# EAGLE design cryptostick-0v1 (EAGLE 6.6.0)

## Sheet 1 of 3: FTDI USB-Conn., FTDI-Chip
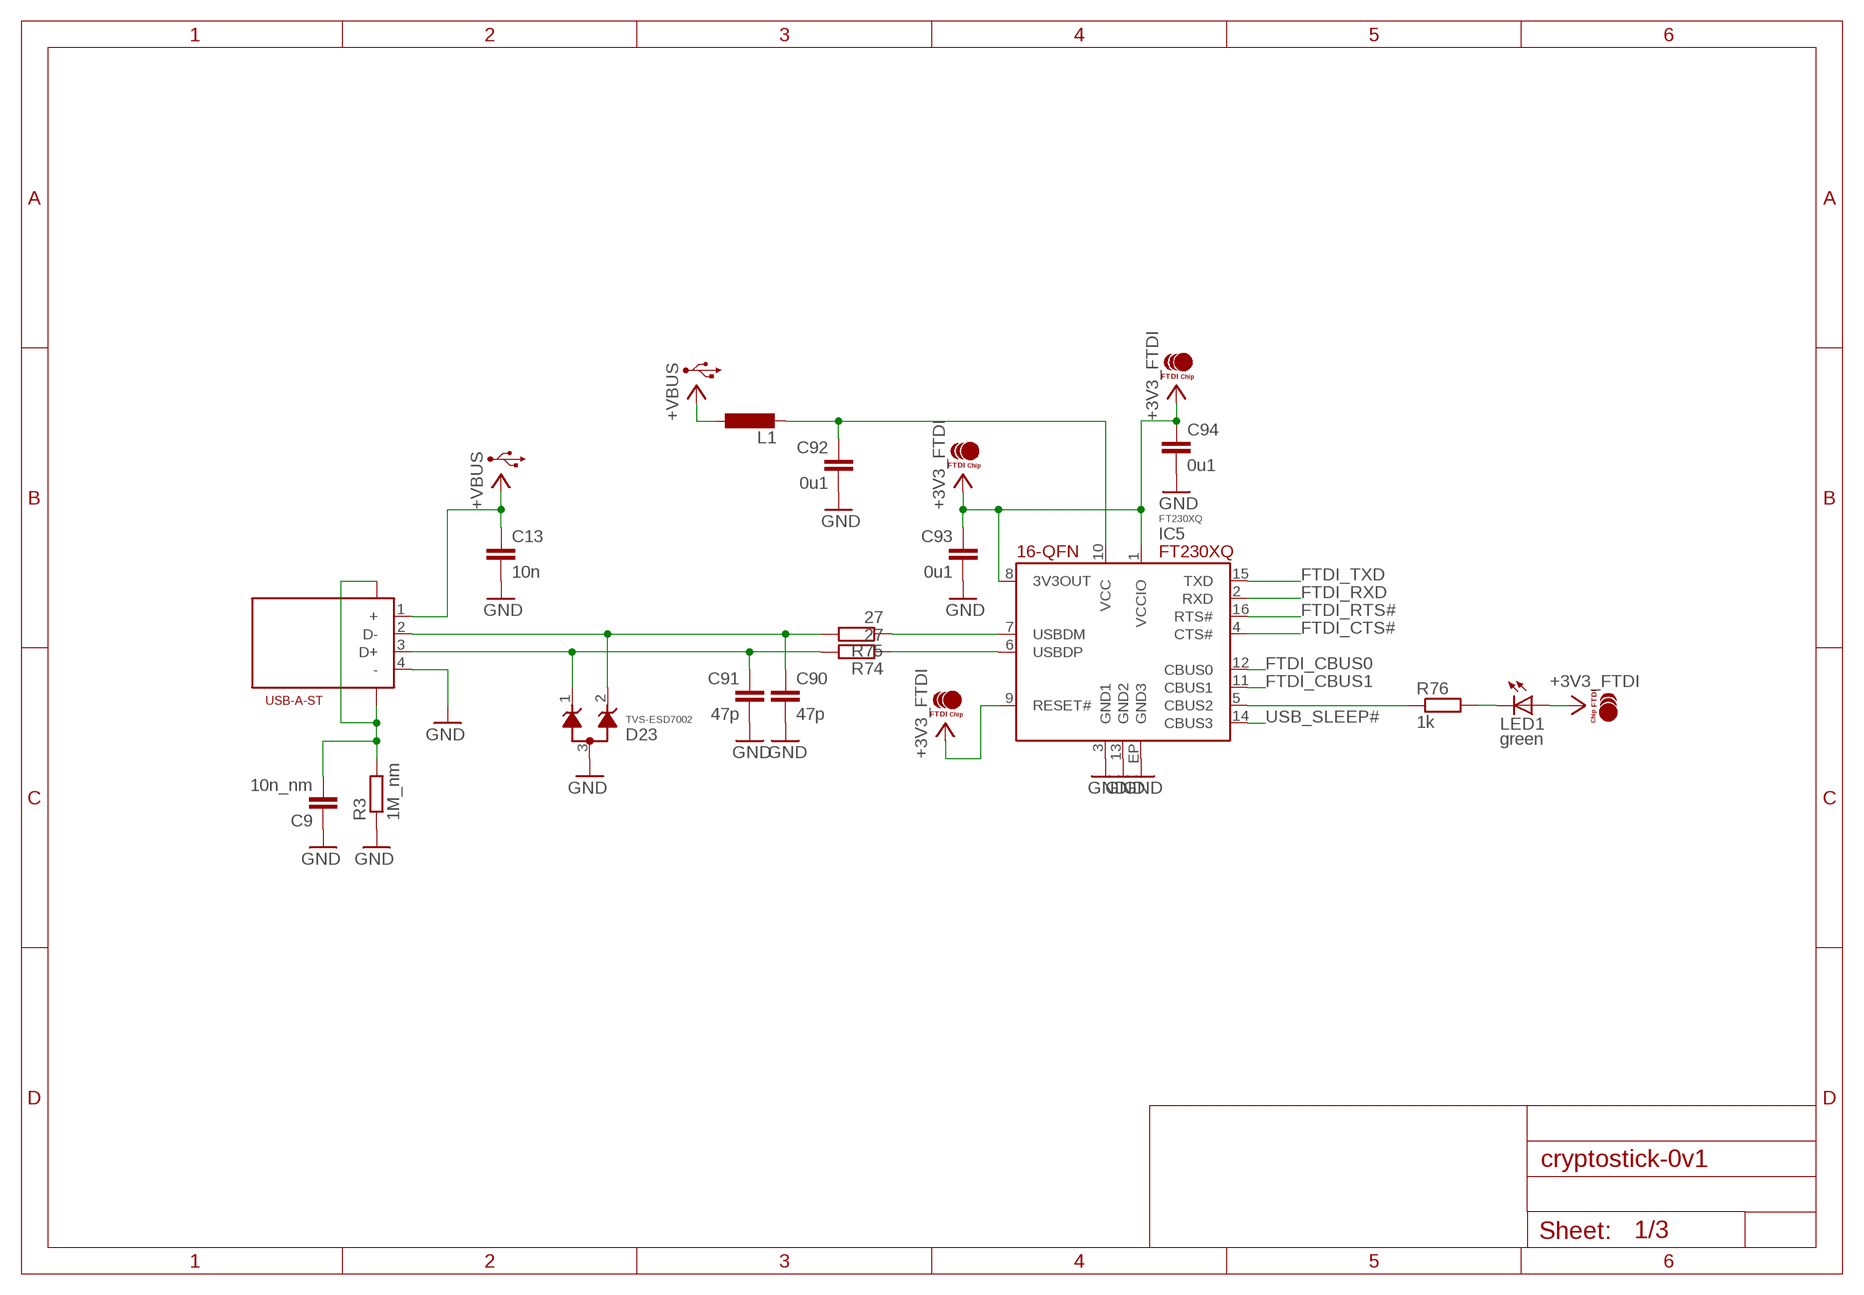
[diagram p0: schematic, sheet 1]

### Parts
C9  10n_nm  C-EUC0603  [C0603]
C13  10n  C-EUR0402-MCU  [R0402-MCU]
C90  47p  C-EUR0402-MCU  [R0402-MCU]
C91  47p  C-EUR0402-MCU  [R0402-MCU]
C92  0u1  C-EUR0402-MCU  [R0402-MCU]
C93  0u1  C-EUR0402-MCU  [R0402-MCU]
C94  0u1  C-EUR0402-MCU  [R0402-MCU]
D23  TVS-ESD7002  [SC70-3]
IC5  FT230XQ  [16QFN-FT230X]
J1  USB-A-ST  [USB-A-ST]
L1  L-EUR0402-MCU  [R0402-MCU]
LED1  green  LED-0603-SIDELED-RPI  [0603-SIDELED-RPI]
R3  1M_nm  R-EU_R0603  [R0603]
R74  27  R-EU_R0402-MCU  [R0402-MCU]
R75  27  R-EU_R0402-MCU  [R0402-MCU]
R76  1k  R-EU_R0402-MCU  [R0402-MCU]

### Nets
+3V3_FTDI: C93.1 C94.1 IC5.1(VCCIO) IC5.8(3V3OUT) IC5.9(RESET#) LED1.A ; also sheet 2,3
+5V_FTDI: C92.1 IC5.10(VCC) L1.2
+VBUS: C13.1 J1.1(+) L1.1 ; also sheet 3
FTDI_CBUS0: IC5.12(CBUS0) ; also sheet 2
FTDI_CBUS1: IC5.11(CBUS1) ; also sheet 2
FTDI_CTS#: IC5.4(CTS#) ; also sheet 2
FTDI_RTS#: IC5.16(RTS#) ; also sheet 2
FTDI_RXD: IC5.2(RXD) ; also sheet 2
FTDI_TXD: IC5.15(TXD) ; also sheet 2
FTDI_TXLED#: IC5.5(CBUS2) R76.1
GND: C9.1 C13.2 C90.2 C91.2 C92.2 C93.2 C94.2 D23.3 IC5.3(GND1) IC5.13(GND2) IC5.EP(GND3) J1.4(-) R3.1 ; also sheet 2,3
N$10: LED1.C R76.2
N$39: IC5.7(USBDM) R75.1
N$40: IC5.6(USBDP) R74.1
N$75: C91.1 D23.1 J1.3(D+) R74.2
N$76: C90.1 D23.2 J1.2(D-) R75.2
USB_SHLD: C9.2 J1.SH1 J1.SH2 R3.2
USB_SLEEP#: IC5.14(CBUS3) ; also sheet 2

## Sheet 2 of 3: MCU MSP430 Microcontroller, Crypto-IC
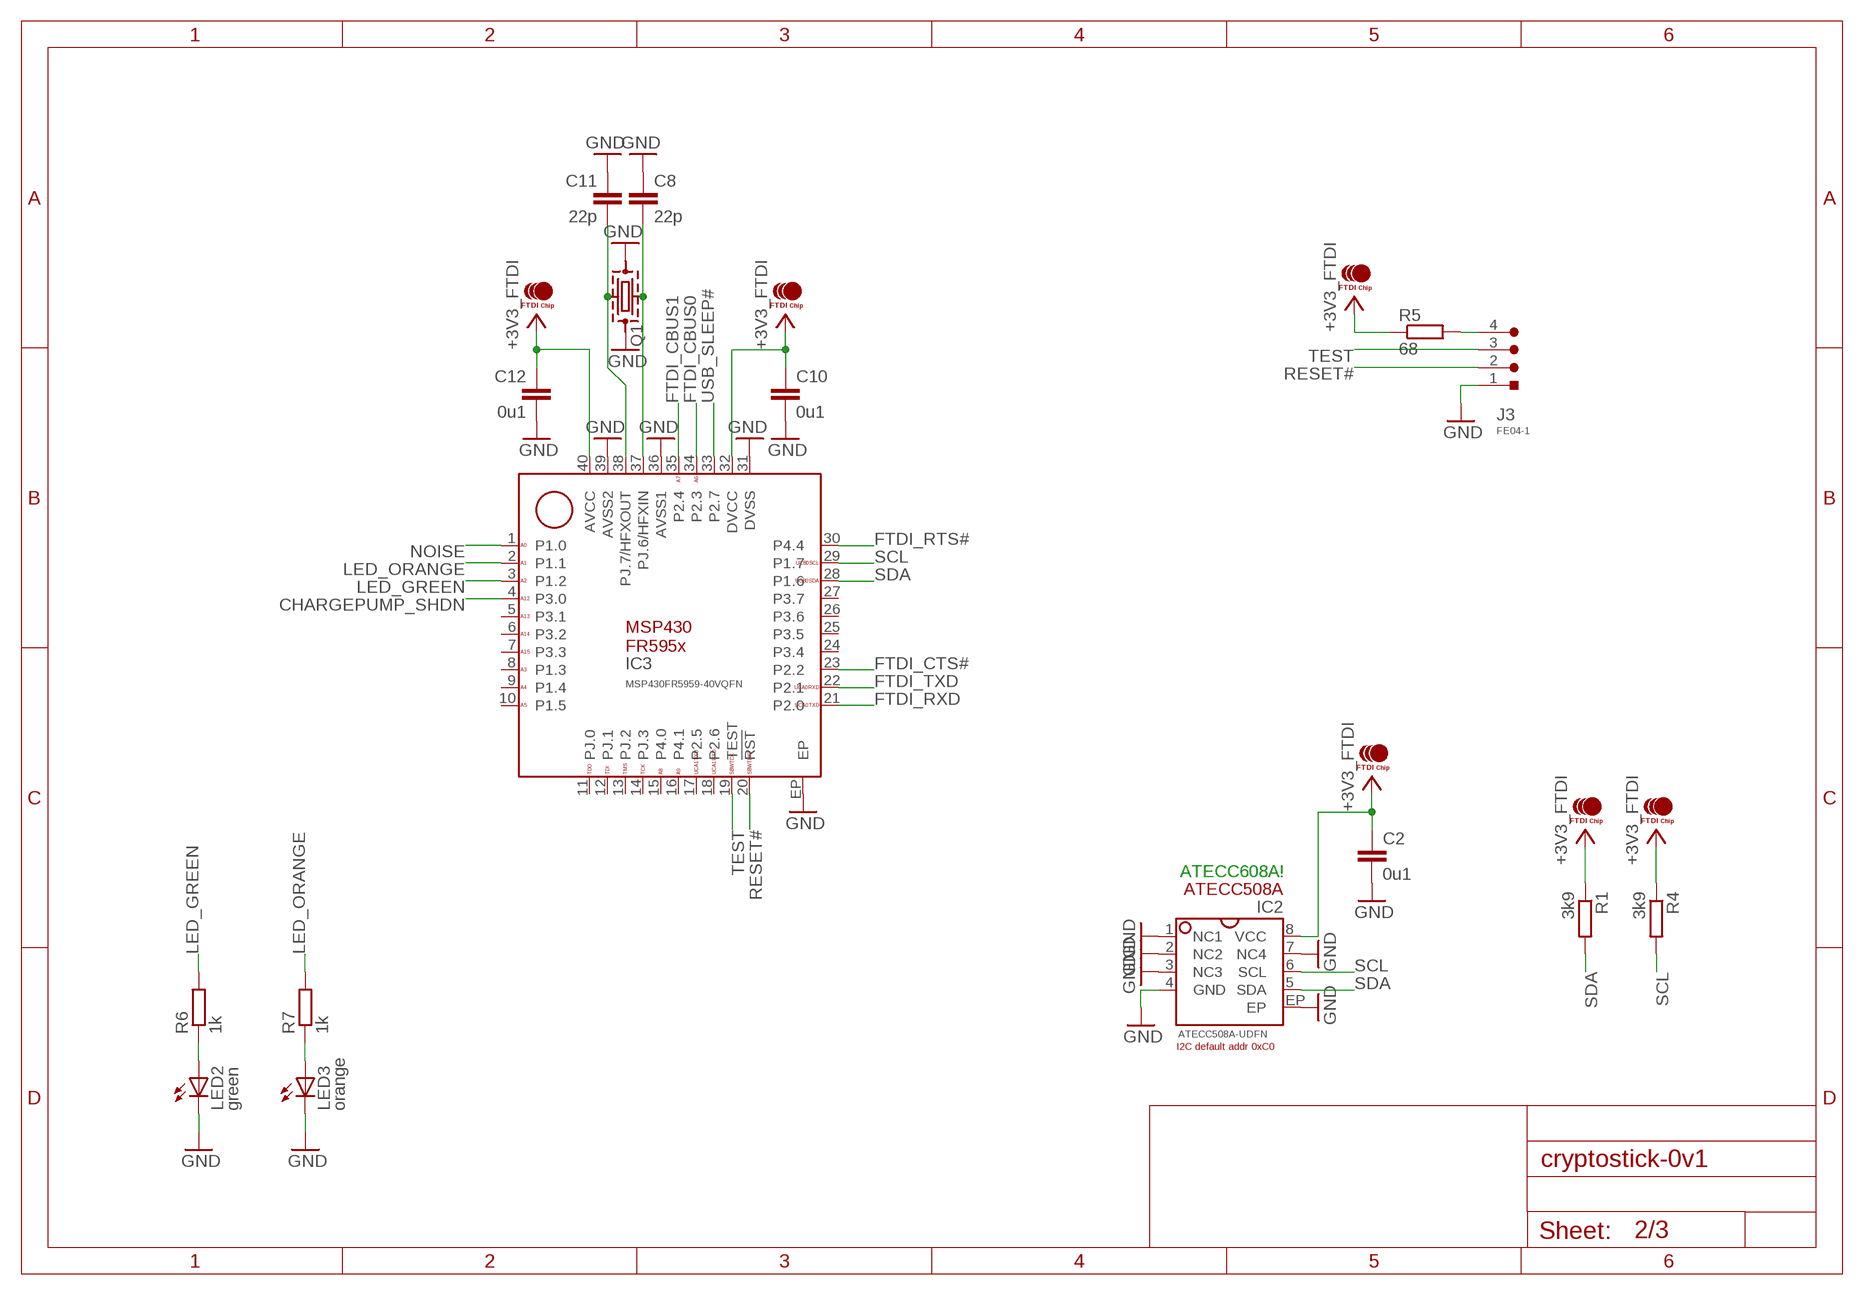
[diagram p1: schematic, sheet 2]

### Parts
C2  0u1  C-EUR0402-MCU  [R0402-MCU]
C8  22p  C-EUR0402-MCU  [R0402-MCU]
C10  0u1  C-EUR0402-MCU  [R0402-MCU]
C11  22p  C-EUR0402-MCU  [R0402-MCU]
C12  0u1  C-EUR0402-MCU  [R0402-MCU]
IC2  ATECC508A-UDFN  [8UDFN]
IC3  MSP430FR5959-40VQFN  [40VQFN-MSP430FR5959]
J3  FE04-1  [FE04-1]
LED2  green  LED-0603-SIDELED-RPI  [0603-SIDELED-RPI]
LED3  orange  LED-0603-SIDELED-RPI  [0603-SIDELED-RPI]
Q1  XTAL-2.0X1.6  [XTAL-30MHZ-2.0X1.6]
R1  3k9  R-EU_R0402-MCU  [R0402-MCU]
R4  3k9  R-EU_R0402-MCU  [R0402-MCU]
R5  68  R-EU_R0402-MCU  [R0402-MCU]
R6  1k  R-EU_R0402-MCU  [R0402-MCU]
R7  1k  R-EU_R0402-MCU  [R0402-MCU]

### Nets
+3V3_FTDI: C2.1 C10.1 C12.1 IC2.8(VCC) IC3.32(DVCC) IC3.40(AVCC) R1.1 R4.1 R5.1 ; also sheet 1,3
CHARGEPUMP_SHDN: IC3.4(P3.0) ; also sheet 3
FTDI_CBUS0: IC3.34(P2.3) ; also sheet 1
FTDI_CBUS1: IC3.35(P2.4) ; also sheet 1
FTDI_CTS#: IC3.23(P2.2) ; also sheet 1
FTDI_RTS#: IC3.30(P4.4) ; also sheet 1
FTDI_RXD: IC3.21(P2.0) ; also sheet 1
FTDI_TXD: IC3.22(P2.1) ; also sheet 1
GND: C2.2 C8.1 C10.2 C11.1 C12.2 IC2.1(NC1) IC2.2(NC2) IC2.3(NC3) IC2.4(GND) IC2.7(NC4) IC2.EP IC3.31(DVSS) IC3.36(AVSS1) IC3.39(AVSS2) IC3.EP J3.1 LED2.C LED3.C Q1.2(GND1) Q1.4(GND2) ; also sheet 1,3
LED_GREEN: IC3.3(P1.2) R6.2
LED_ORANGE: IC3.2(P1.1) R7.2
N$1: J3.4 R5.2
N$3: LED3.A R7.1
N$4: LED2.A R6.1
N$11: C11.2 IC3.38(PJ.7/HFXOUT) Q1.1
N$13: C8.2 IC3.37(PJ.6/HFXIN) Q1.3
NOISE: IC3.1(P1.0) ; also sheet 3
RESET#: IC3.20(!RST) J3.2
SCL: IC2.6(SCL) IC3.29(P1.7) R4.2
SDA: IC2.5(SDA) IC3.28(P1.6) R1.2
TEST: IC3.19(TEST) J3.3
USB_SLEEP#: IC3.33(P2.7) ; also sheet 1
Unconnected: IC3.5(P3.1) IC3.6(P3.2) IC3.7(P3.3) IC3.8(P1.3) IC3.9(P1.4) IC3.10(P1.5) IC3.11(PJ.0) IC3.12(PJ.1) IC3.13(PJ.2) IC3.14(PJ.3) IC3.15(P4.0) IC3.16(P4.1) IC3.17(P2.5) IC3.18(P2.6) IC3.24(P3.4) IC3.25(P3.5) IC3.26(P3.6) IC3.27(P3.7)

### Notes on the sheet
- ATECC608A!

## Sheet 3 of 3: TRNG True Random Noise Generator: Noise Diode, Charge Pump
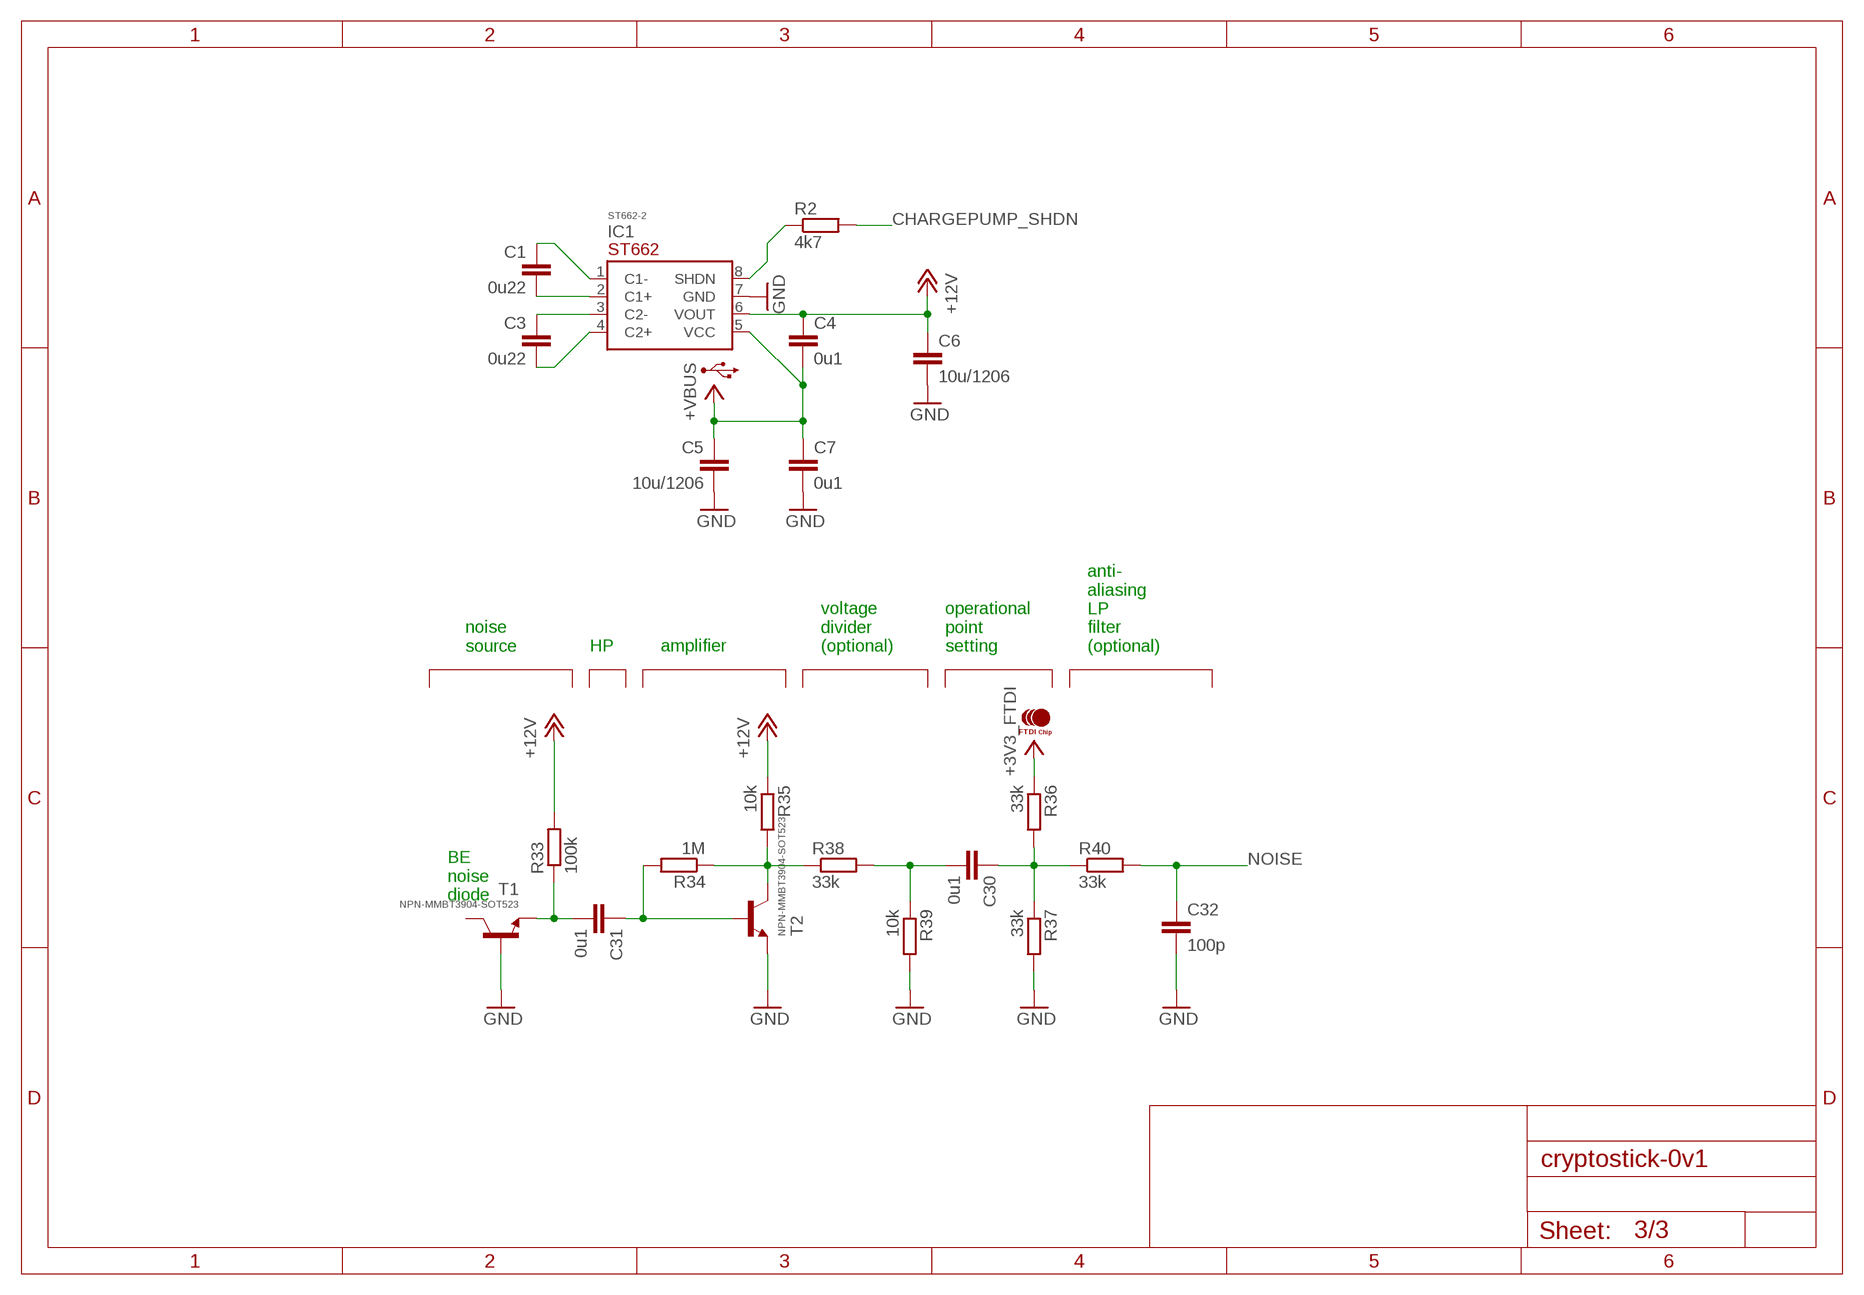
[diagram p2: schematic, sheet 3]

### Parts
C1  0u22  C-EUC0603  [C0603]
C3  0u22  C-EUC0603  [C0603]
C4  0u1  C-EUR0402-MCU  [R0402-MCU]
C5  10u/1206  C-EUC1206  [C1206]
C6  10u/1206  C-EUC1206  [C1206]
C7  0u1  C-EUR0402-MCU  [R0402-MCU]
C30  0u1  C-EUR0402-MCU  [R0402-MCU]
C31  0u1  C-EUR0402-MCU  [R0402-MCU]
C32  100p  C-EUR0402-MCU  [R0402-MCU]
IC1  ST662-2  [8SOIC-2]
R2  4k7  R-EU_R0402-MCU  [R0402-MCU]
R33  100k  R-EU_R0402-MCU  [R0402-MCU]
R34  1M  R-EU_R0402-MCU  [R0402-MCU]
R35  10k  R-EU_R0402-MCU  [R0402-MCU]
R36  33k  R-EU_R0402-MCU  [R0402-MCU]
R37  33k  R-EU_R0402-MCU  [R0402-MCU]
R38  33k  R-EU_R0402-MCU  [R0402-MCU]
R39  10k  R-EU_R0402-MCU  [R0402-MCU]
R40  33k  R-EU_R0402-MCU  [R0402-MCU]
T1  NPN-MMBT3904-SOT523  [SOT523]
T2  NPN-MMBT3904-SOT523  [SOT523]

### Nets
+3V3_FTDI: R36.1 ; also sheet 1,2
+12V: C4.1 C6.1 IC1.6(VOUT) R33.2 R35.1
+VBUS: C4.2 C5.1 C7.1 IC1.5(VCC) ; also sheet 1
CHARGEPUMP_SHDN: R2.2 ; also sheet 2
GND: C5.2 C6.2 C7.2 C32.2 IC1.7(GND) R37.2 R39.2 T1.1(B) T2.2(E) ; also sheet 1,2
N$2: C31.1 R34.2 T2.1(B)
N$5: R34.1 R35.2 R38.1 T2.3(C)
N$6: C3.1 IC1.3(C2-)
N$7: C1.2 IC1.2(C1+)
N$8: C1.1 IC1.1(C1-)
N$9: C3.2 IC1.4(C2+)
N$12: IC1.8(SHDN) R2.1
N$35: C31.2 R33.1 T1.2(E)
N$42: C30.1 R36.2 R37.1 R40.1
N$43: C30.2 R38.2 R39.1
NOISE: C32.1 R40.2 ; also sheet 2
Unconnected: T1.3(C)

### Notes on the sheet
- noise
  source
- HP | amplifier
- voltage
  divider
  (optional)
- operational
  point
  setting
- anti-
  aliasing
  LP
  filter
  (optional)
- BE
  noise
  diode

## Library data of the parts
C1-C13 C30-C32 C90-C94 = rcl:C-EU: CAPACITOR, European symbol
D23 = hg-box:TVS-ESD7002
IC1 = cryptostick:ST662
IC2 = hg-box:ATECC508A-UDFN
IC3 = cryptostick:MSP430FR5959
IC5 = bdsm:FT230XQ
J1 = cocs:USB-A-ST
J3 = cryptostick:FE04-1
L1 = rcl:L-EU: INDUCTOR, European symbol
LED1-LED3 = led:LED: LED OSRAM: - CHIPLED LG R971, LG N971, LY N971, LG Q971, LY Q971, LO R971, LY R971 LH N974, LH R974 LS Q976, LO Q976, LY Q976 LO Q996 - Hyper CHIPLED LW Q18S LB Q993, LB Q99A, LB R99A - SideLED LS A670, LO A670, LY A670, LG A670, LP A670 LB A673, LV A673, LT A673, LW A673 LH A674 LY A675 LS A676, LA A676, LO A676, LY A676, LW A676 LS A679, LY A679, LG A679 - Hyper Micro SIDELED® LS Y876, LA Y876, LO Y876, LY Y876 LT Y87S - SmartLED LW L88C, LW L88S LB L89C, LB L89S, LG L890 LS L89K, LO L89K, LY L89K LS L896, LA L896, LO L896, LY L896 - TOPLED LS T670, LO T670, LY T670, LG T670, LP T670 LSG T670, LSP T670, LSY T670, LOP T670, LYG T670 LG T671, LOG T671, LSG T671 LB T673, LV T673, LT T673, LW T673 LH T674 LS T676, LA T676, LO T676, LY T676, LB T676, LH T676, LSB T676, LW T676 LB T67C, LV T67C, LT T67C, LS T67K, LO T67K, LY T67K, LW E67C LS E67B, LA E67B, LO E67B, LY E67B, LB E67C, LV E67C, LT E67C LW T67C LS T679, LY T679, LG T679 LS T770, LO T770, LY T770, LG T770, LP T770 LB T773, LV T773, LT T773, LW T773 LH T774 LS E675, LA E675, LY E675, LS T675 LS T776, LA T776, LO T776, LY T776, LB T776 LHGB T686 LT T68C, LB T68C - Hyper Mini TOPLED® LB M676 - Mini TOPLED Santana® LG M470 LS M47K, LO M47K, LY M47K Source: http://www.osram.convergy.de LUXEON: - LUMILED® LXK2-PW12-R00, LXK2-PW12-S00, LXK2-PW14-U00, LXK2-PW14-V00 LXK2-PM12-R00, LXK2-PM12-S00, LXK2-PM14-U00 LXK2-PE12-Q00, LXK2-PE12-R00, LXK2-PE12-S00, LXK2-PE14-T00, LXK2-PE14-U00 LXK2-PB12-K00, LXK2-PB12-L00, LXK2-PB12-M00, LXK2-PB14-N00, LXK2-PB14-P00, LXK2-PB14-Q00 LXK2-PR12-L00, LXK2-PR12-M00, LXK2-PR14-Q00, LXK2-PR14-R00 LXK2-PD12-Q00, LXK2-PD12-R00, LXK2-PD12-S00 LXK2-PH12-R00, LXK2-PH12-S00 LXK2-PL12-P00, LXK2-PL12-Q00, LXK2-PL12-R00 Source: www.luxeon.com KINGBRIGHT: KA-3528ASYC Source: www.kingbright.com
Q1 = cocs:XTAL
R1-R7 R33-R40 R74-R76 = rcl:R-EU_: RESISTOR, European symbol
T1 T2 = bdsm:NPN-MMBT3904

## Board
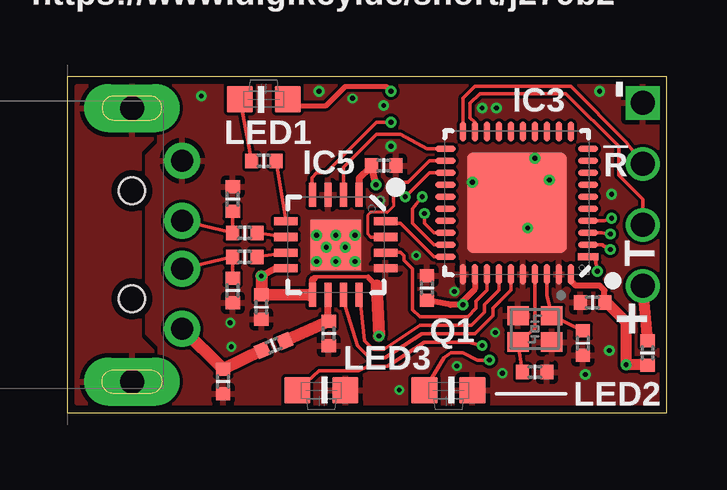
[diagram p3: board, top side]
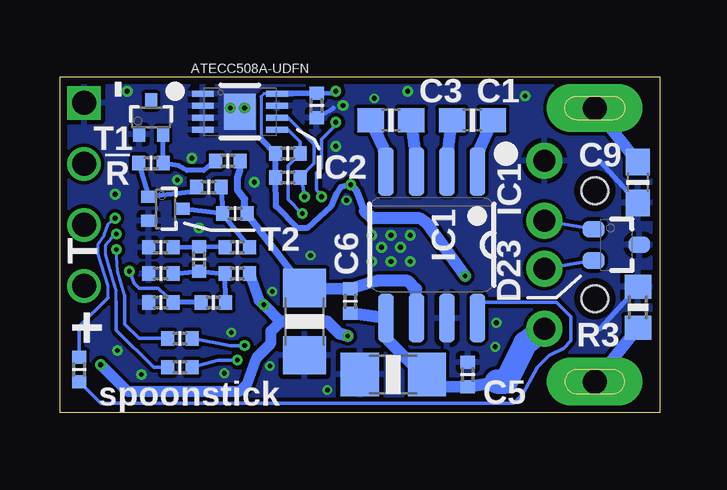
[diagram p4: board, bottom side, seen from below]

Size 25 x 14 mm. Coordinates in mm from the lower left corner, seen from the top.
Outline: 0,0 25,0 25,14 0,14 0,0
Copper layers (1*16): Top 0.035mm / dielectric 1.5mm / Bottom 0.035mm
Design rules "PCB-POOL HighSpec *": minimum track width 0.125mm, minimum drill 0.2mm, track to track 0.125mm, track to pad 0.125mm, pad to pad 0.125mm, via to via 0.125mm, smd to smd 0.125mm, copper to edge 0.3mm, drill to drill 0.2mm, minimum pad ring 0.2mm, minimum via ring 0.1mm, stop-mask expansion 0.075mm, vias tented up to drill 0mil, thermal gap 0.2mm

### Footprints (pad centres in the part's own frame; a part is rotated, then mirrored left to right if it is on the bottom)
C0603 = smd 1.1 x 1: 1 -0.85,0; 2 0.85,0
R0402-MCU = smd 0.54 x 0.6: 1 -0.51,0; 2 0.51,0
C1206 = smd 1.6 x 1.8: 1 -1.4,0; 2 1.4,0
SC70-3 = smd 0.7 x 0.9: 1 -0.65,-0.95; 2 0.65,-0.95; 3 0,0.95
8SOIC-2 = smd 0.66 x 2: 1 -1.905,-3.05; 2 -0.635,-3.05; 3 0.635,-3.05; 4 1.905,-3.05; 5 1.905,3.05; 6 0.635,3.05; 7 -0.635,3.05; 8 -1.905,3.05
8UDFN = smd 0.9 x 0.25: 1 -1.55,0.75; 2 -1.55,0.25; 3 -1.55,-0.25; 4 -1.55,-0.75; 5 1.55,-0.75; 6 1.55,-0.25; 7 1.55,0.25; 8 1.55,0.75 | smd 1.3 x 1.5: EP 0,0
40VQFN-MSP430FR5959 = smd 0.85 x 0.28: 1 -2.975,2.25; 2 -2.975,1.75; 3 -2.975,1.25; 4 -2.975,0.75; 5 -2.975,0.25; 6 -2.975,-0.25; 7 -2.975,-0.75; 8 -2.975,-1.25; 9 -2.975,-1.75; 10 -2.975,-2.25; 21 2.975,-2.25; 22 2.975,-1.75; 23 2.975,-1.25; 24 2.975,-0.75; 25 2.975,-0.25; 26 2.975,0.25; 27 2.975,0.75; 28 2.975,1.25; 29 2.975,1.75; 30 2.975,2.25 | smd 0.28 x 0.85: 11 -2.25,-2.975; 12 -1.75,-2.975; 13 -1.25,-2.975; 14 -0.75,-2.975; 15 -0.25,-2.975; 16 0.25,-2.975; 17 0.75,-2.975; 18 1.25,-2.975; 19 1.75,-2.975; 20 2.25,-2.975; 31 2.25,2.975; 32 1.75,2.975; 33 1.25,2.975; 34 0.75,2.975; 35 0.25,2.975; 36 -0.25,2.975; 37 -0.75,2.975; 38 -1.25,2.975; 39 -1.75,2.975; 40 -2.25,2.975 | smd 4.15 x 4.15: EP 0,0
16QFN-FT230X = smd 1 x 0.325: 1 -2.08,0.975; 2 -2.08,0.325; 3 -2.08,-0.325; 4 -2.08,-0.975; 9 2.08,-0.975; 10 2.08,-0.325; 11 2.08,0.325; 12 2.08,0.975 | smd 0.325 x 1: 5 -0.975,-2.08; 6 -0.325,-2.08; 7 0.325,-2.08; 8 0.975,-2.08; 13 0.975,2.08; 14 0.325,2.08; 15 -0.325,2.08; 16 -0.975,2.08 | smd 2.1 x 2.1: EP 0,0
USB-A-ST = drill 0.92 pad 1.5: 1 3.5,4.8; 2 1,4.8; 3 -1,4.8; 4 -3.5,4.8 | drill 1 pad 2 long: SH1 5.7,2.7; SH2 -5.7,2.7 | hole 1.1: -2.25,2.7; 2.25,2.7
FE04-1 = drill 1 pad 1.4 square: 1 -3.81,0 | drill 1 pad 1.4: 2 -1.27,0; 3 1.27,0; 4 3.81,0
0603-SIDELED-RPI = smd 1.1 x 1.1: A -1,0.235; C 1,0.235
XTAL-30MHZ-2.0X1.6 = smd 0.9 x 0.8: 1 -0.7,-0.55; 2 0.7,-0.55; 3 0.7,0.55; 4 -0.7,0.55
R0603 = smd 1 x 1.1: 1 -0.85,0; 2 0.85,0
SOT523 = smd 0.5 x 0.61: 1 -0.5,-0.7; 2 0.5,-0.7; 3 0,0.7

### Placement (x,y rotation side)
C1  7.8,12.2 180 bottom
C2  14.3,12.8 270 bottom
C3  11.2,12.2 180 bottom
C4  12.9,4.65 270 bottom
C5  11.1,1.6 180 bottom
C6  14.8,3.8 270 bottom
C7  8,1.6 90 bottom
C8  19.5,1.7 180 top
C9  0.9,9.6 90 bottom
C10  15,5.2 90 top
C11  21.5,2.9 90 top
C12  21.9,4.6 180 top
C13  6.5,1.3 270 top
C30  19.2,6.4 90 bottom
C31  21.2,10.4 0 bottom
C32  20.8,4.6 180 bottom
C90  6.9,5.1 270 top
C91  6.9,8.9 90 top
C92  10.9,3.3 270 top
C93  8.1,4.4 270 top
C94  13.2,10.3 0 top
D23  1.8,7 270 bottom
IC1  9.5,7 180 bottom
IC2  17.5,12.55 0 bottom
IC3  18.75,8.75 180 top
IC5  11.2,7 270 top
J1  0,7 270 top
J3  24,9.1 270 top
L1  8.6,2.8 22.5 top
LED1  8.2,13.3 180 top
LED2  15.9,0.7 0 top
LED3  10.6,0.7 0 top
Q1  19.5,3.5 180 top
R1  15.5,10.8 0 bottom
R2  24.2,1.8 90 bottom
R3  0.9,4.4 270 bottom
R4  15.5,9.8 0 bottom
R5  24.2,2.5 90 top
R6  20,1.9 180 bottom
R7  20,3.1 180 bottom
R33  18,10.5 0 bottom
R34  18.8,9.4 180 bottom
R35  17.7,8.3 180 bottom
R36  17.6,5.8 180 bottom
R37  20.8,5.8 180 bottom
R38  17.6,6.9 180 bottom
R39  20.8,6.9 180 bottom
R40  18.6,4.6 180 bottom
R74  7.4,7.5 180 top
R75  7.4,6.5 180 top
R76  8.2,10.5 180 top
T1  21.2,12.3 0 bottom
T2  20.6,8.5 270 bottom

### Tracks (layer width: path | path; a pad name or v marks a point on that pad's centre or on a via)
+3V3_FTDI  (via drill 0.2 pad 0.45)
  Top 0.15: 10.3,5.6 10.38,5.67 12.53,5.67 12.55,5.65
  Top 0.2: LED1.A 9.5,12.8 10.8,12.8 11.6,13.6 13.3,13.6 v13.5,13.4 | 12.55,5.65 12.9,5.3
  Top 0.25: IC3.32 17,5.15 16.5,4.65 v16.5,4.5 16,4.5 C10.1 | C12.1 22.4,5.1 22.2,5.3 21.2,5.3 21,5.5 IC3.40
  Top 0.3: IC5.8 8.71,6.03 v8.1,5.7 | 10.1,4.9 IC5.9 10.22,5.53 10.3,5.6 | IC5.1 12.18,9.78 12.6,10.2 C94.1 v12.88,9.5
  Top 0.45: R5.1 v23.3,2 23.3,3.8 22.4,4.7 C12.1
  Top 0.5: v8.1,5.7 C93.1 10.1,4.9 | 12.9,5.3 v13,3.2
  Bottom 0.125: IC2.8 16.5,13.3 16.62,13.18 16.62,11.43 16.6,11.4
  Bottom 0.2: v13.5,13.4 13.6,13.3 C2.1
  Bottom 0.25: C2.1 15.3,13.3 IC2.8 | v12.88,9.5 13.3,9.4 13.5,9.1 13.7,8.6 14.7,7.7 15.1,7.7 16,8.6 R4.1 R1.1 16.6,11.4
  Bottom 0.3: 12.3,8.4 12.6,9.2 v12.88,9.5
  Bottom 0.45: v23.3,2 22.2,0.9 17.5,0.9 17.2,1.2 16.8,2.3 16.2,2.9 16.2,3.4 15.8,3.8 v16.5,4.5 16.7,4.7 R36.1
  Bottom 0.5: v8.1,5.7 9.7,7.9 10,8.1 12,8.1 12.3,8.4 | v13,3.2 13.35,3.3 13.85,3.8 15.8,3.8
+5V_FTDI
  Top 0.3: C92.1 10.88,4.1 IC5.10
  Top 0.5: L1.2 C92.1
+12V
  Bottom 0.3: C6.1 R35.1 17.3,8.4 17.3,8.9 17.6,9.3 17.6,9.8 17.5,10.1 17.5,10.3 R33.2
  Bottom 0.5: IC1.6 10.15,5.15 10.5,5.5 11.8,5.5 C4.1 C6.1
+VBUS
  Top 0.5: J1.1 C13.1 L1.1
  Bottom 0.5: C4.2 IC1.5 11.3,3 10.4,2.1 C5.1 9.5,1.1 C7.1 6.8,1.3
  Bottom 1: 6.8,1.3 6.4,1.3 5.6,2.9 J1.1
CHARGEPUMP_SHDN  (via drill 0.2 pad 0.45)
  Top 0.15: v22.7,8.1 22.4,8 IC3.4
  Bottom 0.125: 23,4.8 23,5.3 23.4,6.6 23.4,7.05 23.15,7.4 23,7.85 v22.7,8.1
  Bottom 0.15: R2.2 24.2,3.6 23,4.8
FTDI_CBUS0
  Top 0.15: IC5.12 12.25,4.35 12.4,3 12.75,2.65 13.2,2.65 14.7,3.65 16.85,3.65 17.4,4.2 17.4,4.5 18,5.1 IC3.34
FTDI_CBUS1
  Top 0.15: IC3.35 18.5,5.1 17.75,4.35 17.75,4.05 17,3.3 14.8,3.3 13.25,2.3 12.6,2.3 12.1,2.8 11.6,4.4 IC5.11
FTDI_CTS#  (via drill 0.2 pad 0.45)
  Top 0.15: IC5.4 10.2,9.8 10.4,10 10.8,10 12.9,12.1 v13.5,12.1 | v14.1,9 15.1,10 IC3.23
  Bottom 0.15: v13.5,12.1 13.5,12 14.1,11.4 14.1,10.2 14.3,10 14.3,9.3 v14.1,9
FTDI_RTS#
  Top 0.15: IC5.16 13.5,7.9 13.9,7.9 15.3,6.5 IC3.30
FTDI_RXD
  Top 0.15: IC5.2 11.53,10.22 12.9,11.6 13.9,11.6 15,11 IC3.21
FTDI_TXD
  Top 0.125: 13.6,8.8 13.6,8.6 13.35,8.35 12.65,8.35 12.53,8.22 12.53,7.47 12.68,7.33
  Top 0.15: IC3.22 15.1,10.5 14.2,9.6 14,9.6 13.6,9.2 13.6,8.8 | 12.68,7.33 IC5.15
FTDI_TXLED#
  Top 0.15: R76.1 IC5.5
GND  (via drill 0.2 pad 0.4, 0.2 pad 0.45)
  Bottom 0.2: R3.1 2.5,3.5 | C9.1 2.5,10.5 | C2.2 13.6,12.7
  other vias: 22.2,13.4 5.6,13.2 10.5,13.4 16.9,9.6 13.5,11.1 17.3,12.7 11.2,6.3 13.05,8.85 19.5,10.6 13.2,12.8 11.9,13.1 21.6,1.6 22.7,9.1 6.85,2.75 16.15,5.05 14.55,6.55 16.25,1.95 13.85,0.95 17.85,3.35 18.15,1.65 17.9,12.7 6.8,3.75 22.6,2.6 10.4,7.4 10.4,6.3 12,6.3 12,7.4 19.2,7.7 20.1,9.7 11.2,7.4 10.8,6.9 11.6,6.9
  pour Top (isolate 0.125, rank 2): 24.62,13.62 24.62,0.38 0.38,0.38 0.38,13.62
  pour Bottom (isolate 0.15): 24.62,13.62 24.62,0.38 0.38,0.38 0.38,13.62
LED_GREEN  (via drill 0.2 pad 0.45)
  Top 0.15: v22.65,7.45 22.3,7.5 IC3.3
  Bottom 0.125: 22.65,4.65 22.65,5.1 22.9,5.95 23.1,6.6 23.1,7 22.85,7.3
  Bottom 0.15: R6.2 21.1,1.9 22.65,3.45 22.65,4.65 | 22.85,7.3 v22.65,7.45
LED_ORANGE  (via drill 0.2 pad 0.45)
  Top 0.15: v22.65,6.8 22.3,7 IC3.2
  Bottom 0.125: 22.3,4.9 22.6,5.9 v22.65,6.8
  Bottom 0.15: R7.2 21.7,3.1 22.3,3.7 22.3,4.9
N$1
  Top 0.45: R5.2 J3.4
N$2
  Bottom 0.2: C31.1 T2.1 19.6,9.2 R34.2
N$3  (via drill 0.2 pad 0.45)
  Top 0.15: LED3.A 10,1.3 10.5,1.75 12.15,1.75 12.55,1.95 13.35,1.95 14.9,2.95 16.75,2.95 v17.3,2.8
  Bottom 0.15: v17.3,2.8 17.9,2.8 R7.1
N$4  (via drill 0.2 pad 0.45)
  Top 0.15: LED2.A 15.7,2.3 16,2.5 16.5,2.5 17.1,2.2 v17.6,2.2
  Bottom 0.15: v17.6,2.2 18.4,2.2 R6.1
N$5
  Bottom 0.2: R35.2 T2.3 | R34.1 R35.2 | R38.1 R35.2
N$6
  Bottom 0.5: IC1.3 10.2,11 C3.1
N$7
  Bottom 0.5: IC1.2 8.8,11 C1.2
N$8
  Bottom 0.5: IC1.1 7.5,11 C1.1
N$9
  Bottom 0.5: IC1.4 11.5,11 C3.2
N$10
  Top 0.15: LED1.C R76.2
N$11
  Top 0.15: IC3.38 20,4.9 Q1.1 C11.2
N$12
  Bottom 0.15: IC1.8 7.5,4.6 4.3,4.6 3.7,4 3.7,3 4,2.7 4.6,2.4 5.1,1.9 5.7,0.8 6.1,0.4 23.3,0.4 24.1,1.2 R2.1
N$13
  Top 0.15: IC3.37 19.5,3.5 Q1.3 C8.2
N$35
  Bottom 0.2: T1.2 C31.2 20.05,10.3 19.7,10.1 19,10.1 R33.1
N$39
  Top 0.15: R75.1 IC5.7
N$40
  Top 0.15: IC5.6 R74.1
N$42
  Bottom 0.2: R37.1 C30.1 R36.2 R40.1
N$43
  Bottom 0.2: R38.2 C30.2 R39.1
N$75
  Top 0.15: C91.1 R74.2 J1.3
  Bottom 0.15: D23.1 J1.3
N$76
  Top 0.15: C90.1 R75.2 J1.2
  Bottom 0.15: D23.2 J1.2
NOISE  (via drill 0.2 pad 0.45)
  Top 0.15: IC3.1 22,6.5 v22.1,5.9
  Bottom 0.15: v22.1,5.9 21.9,5.4 21.7,5.2 20.9,5.2 C32.1
  Bottom 0.2: R40.2 C32.1
RESET#
  Top 0.15: IC3.20 16.5,13.1 17,13.6 21,13.6 23.3,11.3 J3.2
SCL  (via drill 0.2 pad 0.45)
  Top 0.15: v14.8,9 14.4,8.5 14.4,7.9 15.3,7 IC3.29
  Bottom 0.15: IC2.6 15.5,12.3 14.4,11.2 14.4,10.4 R4.2 14.9,9.6 v14.8,9
SDA  (via drill 0.2 pad 0.45)
  Top 0.15: v14.9,8.3 14.9,7.9 15.3,7.5 IC3.28
  Bottom 0.15: IC2.5 15.5,11.8 15,11.3 R1.2 15.5,10.3 15.5,8.9 v14.9,8.3
TEST
  Top 0.15: IC3.19 17,12.1 16.8,12.3 16.8,12.9 17.2,13.3 20.8,13.3 23,11.1 23,9.9 24,8.9 J3.3
USB_SHLD
  Bottom 0.5: C9.2 J1.SH2 | R3.2 J1.SH1
  pour Top (isolate 0.2): 0.4,13.6 4,13.6 4,11.9 3,10.9 3,3.1 4,2.1 4,0.4 0.4,0.4
USB_SLEEP#
  Top 0.15: IC5.14 13.5,6.7 13.9,6.7 14.05,6.55 14.05,6.35 14.4,6 14.4,4.3 14.7,4 16.7,4 17.05,4.35 17.05,4.65 17.5,5.1 IC3.33

### Text on the board
tPlace: https://www.digikey.de/short/j279b2 | - | !R | T | +
bPlace: - | !R | T | + | spoonstick